# Altium schematic sheet Connector_ETH.SchDoc: =SheetTitle_Top
size 420 x 297 mm; EDA_Number: ARTIQ; Author: G.Kasprowicz; CompanyName: WUT ISE; DrawnBy: G.Kasprowicz; Organization: WUT ISE; Address1: PW ISE; Address2: Nowowiejska 15/19 00-665 Warsaw; Address3: gkasprow@gmail.com; ModifiedBy: -; CheckedDate: -; Title2: Connector Ethernet; DivGrp: WUT ISE; Designer: G.Kasprowicz; ModifiedDate: -; ProjectName: Sensor Box
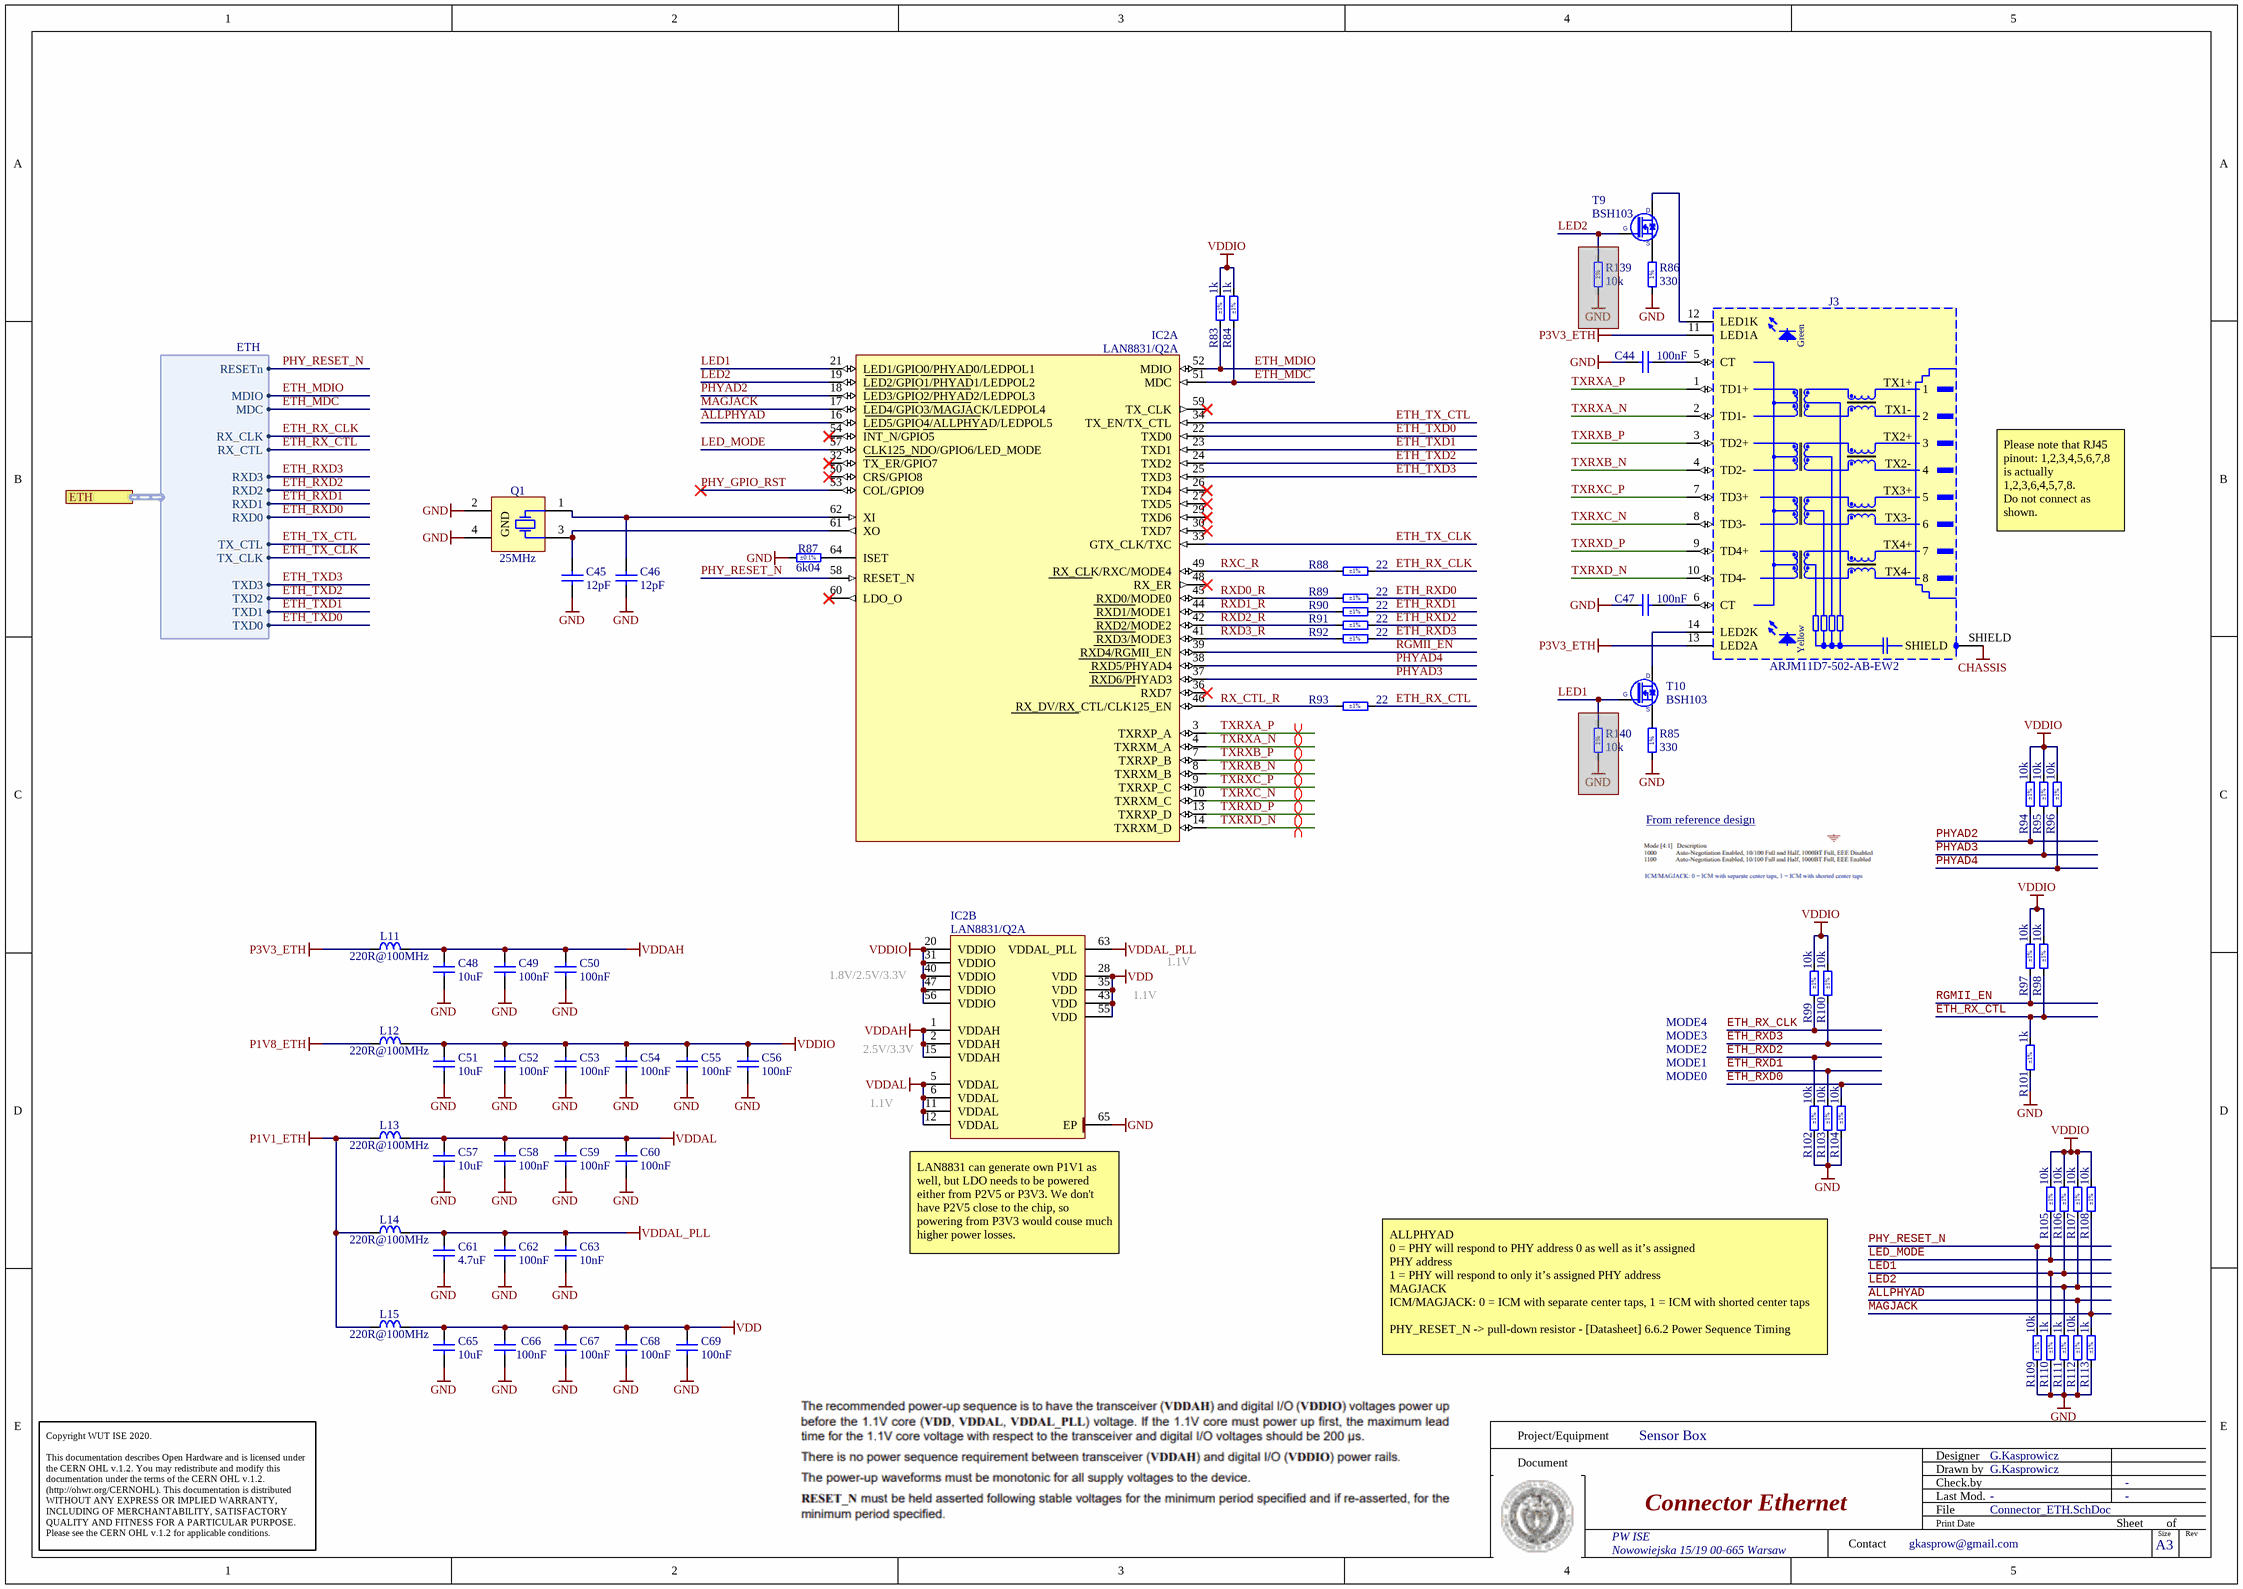
[diagram p0: Connector_ETH.SchDoc]

## Parts
C44  100nF  [CAPC1005X55N]
C45  12pF  [CAPC1005X61N]
C46  12pF  [CAPC1005X61N]
C47  100nF  [CAPC1005X55N]
C48  10uF  [CAPC1005X70N]
C49  100nF  [CAPC1005X55N]
C50  100nF  [CAPC1005X55N]
C51  10uF  [CAPC1005X70N]
C52  100nF  [CAPC1005X55N]
C53  100nF  [CAPC1005X55N]
C54  100nF  [CAPC1005X55N]
C55  100nF  [CAPC1005X55N]
C56  100nF  [CAPC1005X55N]
C57  10uF  [CAPC1005X70N]
C58  100nF  [CAPC1005X55N]
C59  100nF  [CAPC1005X55N]
C60  100nF  [CAPC1005X55N]
C61  4.7uF  [CAPC1005X55N]
C62  100nF  [CAPC1005X55N]
C63  10nF  [CAPC1005X55N]
C65  10uF  [CAPC1005X70N]
C66  100nF  [CAPC1005X55N]
C67  100nF  [CAPC1005X55N]
C68  100nF  [CAPC1005X55N]
C69  100nF  [CAPC1005X55N]
IC2  LAN8831/Q2A  [MICROCHIP_Q2A]  (parts A,B of 2)
J3  ARJM11D7-502-AB-EW2  [ABRACON-ARJM11D7-502-AB-EW2]
L11  220R@100MHz  [INDC2012X105N]
L12  220R@100MHz  [INDC2012X105N]
L13  220R@100MHz  [INDC2012X105N]
L14  220R@100MHz  [INDC2012X105N]
L15  220R@100MHz  [INDC2012X105N]
Q1  25MHz  [XTAL_NDK_NX3225GA]
R83  1k  Tolerance: ±1%  [RESC1005X40N]
R84  1k  Tolerance: ±1%  [RESC1005X40N]
R85  330  [RESC1608X55N]
R86  330  [RESC1608X55N]
R87  6k04  Tolerance: ±0.1%  [RESC1608X55N]
R88  22  Tolerance: ±1%  [RESC1005X40N]
R89  22  Tolerance: ±1%  [RESC1005X40N]
R90  22  Tolerance: ±1%  [RESC1005X40N]
R91  22  Tolerance: ±1%  [RESC1005X40N]
R92  22  Tolerance: ±1%  [RESC1005X40N]
R93  22  Tolerance: ±1%  [RESC1005X40N]
R94  10k  Tolerance: ±1%  [RESC1005X40N]
R95  10k  Tolerance: ±1%  [RESC1005X40N]
R96  10k  Tolerance: ±1%  [RESC1005X40N]
R97  10k  Tolerance: ±1%  [RESC1005X40N]
R98  10k  Tolerance: ±1%  [RESC1005X40N]
R99  10k  Tolerance: ±1%  [RESC1005X40N]
R100  10k  Tolerance: ±1%  [RESC1005X40N]
R101  1k  Tolerance: ±1%  [RESC1005X40N]
R102  10k  Tolerance: ±1%  [RESC1005X40N]
R103  10k  Tolerance: ±1%  [RESC1005X40N]
R104  10k  Tolerance: ±1%  [RESC1005X40N]
R105  10k  Tolerance: ±1%  [RESC1005X40N]
R106  10k  Tolerance: ±1%  [RESC1005X40N]
R107  10k  Tolerance: ±1%  [RESC1005X40N]
R108  10k  Tolerance: ±1%  [RESC1005X40N]
R109  10k  Tolerance: ±1%  [RESC1005X40N]
R110  1k  Tolerance: ±1%  [RESC1005X40N]
R111  1k  Tolerance: ±1%  [RESC1005X40N]
R112  10k  Tolerance: ±1%  [RESC1005X40N]
R113  1k  Tolerance: ±1%  [RESC1005X40N]
R139  10k  [RESC1005X40N]  (masked out: inside a compile mask, not in the netlist)
R140  10k  [RESC1005X40N]  (masked out: inside a compile mask, not in the netlist)
T9  BSH103  [SOT95P230X110-3N]
T10  BSH103  [SOT95P230X110-3N]

## Ports
ETH (harness ETH)

## Harnesses
ETH: RXD3, RXD2, RX_CLK, RX_CTL, RXD1, RXD0, TX_CTL, TX_CLK, TXD3, TXD2, TXD1, TXD0, MDIO, MDC, RESETn

## Nets
CHASSIS: J3.SHIELD
GND: C44.2 C45.1 C46.2 C47.2 C48.1 C49.2 C50.2 C51.1 C52.2 C53.2 C54.2 C55.2 C56.2 C57.1 C58.2 C59.2 C60.2 C61.1 C62.2 C63.1 C65.1 C66.2 C67.2 C68.2 C69.2 IC2.65(EP) Q1.2(GND) Q1.4(GND) R85.1 R86.1 R87.1 R101.1 R102.1 R103.1 R104.1 R109.2 R110.1 R111.1 R112.1 R113.1
P1V1_ETH: L13.1 L14.1 L15.1
P1V8_ETH: L12.1
P3V3_ETH: J3.11(LED1A) J3.13(LED2A) L11.1
VDD: C65.2 C66.1 C67.1 C68.1 C69.1 IC2.28(VDD) IC2.35(VDD) IC2.43(VDD) IC2.55(VDD) L15.2
VDDAH: C48.2 C49.1 C50.1 IC2.1(VDDAH) IC2.2(VDDAH) IC2.15(VDDAH) L11.2
VDDAL: C57.2 C58.1 C59.1 C60.1 IC2.5(VDDAL) IC2.6(VDDAL) IC2.11(VDDAL) IC2.12(VDDAL) L13.2
VDDAL_PLL: C61.2 C62.1 C63.2 IC2.63(VDDAL_PLL) L14.2
VDDIO: C51.2 C52.1 C53.1 C54.1 C55.1 C56.1 IC2.20(VDDIO) IC2.31(VDDIO) IC2.40(VDDIO) IC2.47(VDDIO) IC2.56(VDDIO) L12.2 R83.2 R84.2 R94.2 R95.2 R96.2 R97.2 R98.2 R99.2 R100.2 R105.2 R106.2 R107.2 R108.2
ALLPHYAD: IC2.16(LED5/GPIO4/ALLPHYAD/LEDPOL5) R112.2
ETH_MDC: IC2.51(MDC) R84.1 ; port ETH.MDC
ETH_MDIO: IC2.52(MDIO) R83.1 ; port ETH.MDIO
ETH_RX_CLK: R88.2 R99.1 ; port ETH.RX_CLK
ETH_RX_CTL: R93.2 R98.1 R101.2 ; port ETH.RX_CTL
ETH_RXD0: R89.2 R104.2 ; port ETH.RXD0
ETH_RXD1: R90.2 R103.2 ; port ETH.RXD1
ETH_RXD2: R91.2 R102.2 ; port ETH.RXD2
ETH_RXD3: R92.2 R100.1 ; port ETH.RXD3
ETH_TX_CLK: IC2.33(GTX_CLK/TXC) ; port ETH.TX_CLK
ETH_TX_CTL: IC2.34(TX_EN/TX_CTL) ; port ETH.TX_CTL
ETH_TXD0: IC2.22(TXD0) ; port ETH.TXD0
ETH_TXD1: IC2.23(TXD1) ; port ETH.TXD1
ETH_TXD2: IC2.24(TXD2) ; port ETH.TXD2
ETH_TXD3: IC2.25(TXD3) ; port ETH.TXD3
LED1: IC2.21(LED1/GPIO0/PHYAD0/LEDPOL1) R106.1 R110.2 T10.1(G)
LED2: IC2.19(LED2/GPIO1/PHYAD1/LEDPOL2) R107.1 R111.2 T9.1(G)
LED_MODE: IC2.57(CLK125_NDO/GPIO6/LED_MODE) R105.1
MAGJACK: IC2.17(LED4/GPIO3/MAGJACK/LEDPOL4) R108.1 R113.2
PHY_GPIO_RST: IC2.53(COL/GPIO9)
PHY_RESET_N: IC2.58(RESET_N) R109.1 ; port ETH.RESETn
PHYAD2: IC2.18(LED3/GPIO2/PHYAD2/LEDPOL3) R94.1
PHYAD3: IC2.37(RXD6/PHYAD3) R95.1
PHYAD4: IC2.38(RXD5/PHYAD4) R96.1
RGMII_EN: IC2.39(RXD4/RGMII_EN) R97.1
RX_CTL_R: IC2.46(RX_DV/RX_CTL/CLK125_EN) R93.1
RXC_R: IC2.49(RX_CLK/RXC/MODE4) R88.1
RXD0_R: IC2.45(RXD0/MODE0) R89.1
RXD1_R: IC2.44(RXD1/MODE1) R90.1
RXD2_R: IC2.42(RXD2/MODE2) R91.1
RXD3_R: IC2.41(RXD3/MODE3) R92.1
TXRXA_N: IC2.4(TXRXM_A) J3.2(TD1-)
TXRXA_P: IC2.3(TXRXP_A) J3.1(TD1+)
TXRXB_N: IC2.8(TXRXM_B) J3.4(TD2-)
TXRXB_P: IC2.7(TXRXP_B) J3.3(TD2+)
TXRXC_N: IC2.10(TXRXM_C) J3.8(TD3-)
TXRXC_P: IC2.9(TXRXP_C) J3.7(TD3+)
TXRXD_N: IC2.14(TXRXM_D) J3.10(TD4-)
TXRXD_P: IC2.13(TXRXP_D) J3.9(TD4+)
NetC44_1: C44.1 J3.5(CT)
NetC45_2: C45.2 IC2.61(XO) Q1.3(X)
NetC46_1: C46.1 IC2.62(XI) Q1.1(X)
NetC47_1: C47.1 J3.6(CT)
NetIC2_64: IC2.64(ISET) R87.2
NetJ3_12: J3.12(LED1K) T9.3(D)
NetJ3_14: J3.14(LED2K) T10.3(D)
NetR85_2: R85.2 T10.2(S)
NetR86_2: R86.2 T9.2(S)

Not connected (* = marked no-connect by the designer): IC2 26(TXD4)* 27(TXD5)* 29(TXD6)* 30(TXD7)* 32(TX_ER/GPIO7)* 36(RXD7)* 48(RX_ER)* 50(CRS/GPIO8)* 54(INT_N/GPIO5)* 59(TX_CLK)* 60(LDO_O)*

## Layout directives
differential pair: TXRXA_N, TXRXA_P, TXRXB_N, TXRXB_P, TXRXC_N, TXRXC_P, TXRXD_N, TXRXD_P

## Notes on the sheet
- (near J3) Please note that RJ45 pinout: 1,2,3,4,5,6,7,8 is actually 1,2,3,6,4,5,7,8.
  Do not connect as shown.
- From reference design <https://ww1.microchip.com/downloads/aemDocuments/documents/UNG/ProductDocuments/BoardDesignFiles/LAN8831+Hardware+Reference+Design+-+RGMII+SCH.PDF>
- (near IC2) 1.8V/2.5V/3.3V
- (near IC2) 1.1V
- 1.1V
- (near IC2) 2.5V/3.3V
- MODE4
- MODE3
- MODE2
- MODE1
- MODE0
- (near IC2) LAN8831 can generate own P1V1 as well, but LDO needs to be powered either from P2V5 or P3V3. We don't have P2V5 close to the chip, so powering from P3V3 would couse much higher power losses.
- ALLPHYAD
  0 = PHY will respond to PHY address 0 as well as it’s assigned
  PHY address
  1 = PHY will respond to only it’s assigned PHY address
  MAGJACK
  ICM/MAGJACK: 0 = ICM with separate center taps, 1 = ICM with shorted center taps
  PHY_RESET_N -> pull-down resistor - [Datasheet] 6.6.2 Power Sequence Timing
- Project/Equipment
- Document
- Designer
- Drawn by
- Check.by
- Copyright WUT ISE 2020.
  This documentation describes Open Hardware and is licensed under the CERN OHL v.1.2. You may redistribute and modify this documentation under the terms of the CERN OHL v.1.2. (http://ohwr.org/CERNOHL). This documentation is distributed WITHOUT ANY EXPRESS OR IMPLIED WARRANTY, INCLUDING OF MERCHANTABILITY, SATISFACTORY QUALITY AND FITNESS FOR A PARTICULAR PURPOSE. Please see the CERN OHL v.1.2 for applicable conditions.
- Contact
- File
- Last Mod.
- Print Date
- Sheet
- Size
- A3
- of
- Rev
- (in symbol ABRACON-ARJM11D7-502-AB-EW2) Green; TX1+; TX1-; TX2+; TX2-; TX3+; TX3-; TX4+; TX4-; Yellow
- (in symbol R0402_10K_1%_0.0625W_100PPM) 1%
- (in symbol R0603_330R_1%_0.1W_100PPM) 1%

## Library data of the parts
C44 C47 C49 C50 C52-C56 C58-C60 C62 C66-C69 = CC0402_100NF_25V_10%_X7R_YUDEN_TMK105B7104KVHF: Non-polarised capacitor; Part Description: SMD Multilayer Chip Ceramic Capacitor (High Dielectric Type) for Automotive / Industrial Applications; Manufacturer: TAIYO YUDEN; Voltage: 25V; TC: X7R; Tolerance: ±10%; Part Number: CC0402_100NF_25V_10%_X7R_YUDEN_TMK105B7104KVHF; Component Kind: Standard; Component Type: Standard; Pin Count: 2; Value: 100nF; Status: Not Recommended; Manufacturer Part Number: TMK105B7104KVHF; Case: 0402; Mounted: Yes; Socket: No; SMD: Yes; HelpURL: \\cern.ch\dfs\Applications\Altium\Datasheets\CC0402_TAIYO-YUDEN_TMK105B7104KVHF.pdf; Author: CERN DEM JLC; CreateDate: 10-May-17; LatestRevisionDate: 10-May-17; Sense: No; ComponentHeight: 0.55mm
C45 C46 = CC0402_12PF_50V_1%_NP0_JOHANSON_R07S: Non-polarised capacitor; Part Description: Ultra High-Q SMD Multilayer Capacitor; Manufacturer: JOHANSON TECHNOLOGY; Manufacturer Part Number: 500R07S120FV4T; Voltage: 50V; TC: C0G/NP0; Tolerance: ±1%; Part Number: CC0402_12PF_50V_1%_NP0_JOHANSON_R07S; Component Kind: Standard; Component Type: Standard; Pin Count: 2; Value: 12pF; Status: Not Recommended; Case: 0402; Mounted: Yes; Socket: No; SMD: Yes; Sense: No; ComponentHeight: 0.61mm; HelpURL: \\cern.ch\dfs\Applications\Altium\Datasheets\CC0402_NP0_JOHANSON_R07S.pdf; Author: CERN DEM BC; CreateDate: 20.11.2017; LatestRevisionDate: 26.09.2018
C48 C51 C57 C65 = CC0402_10UF_6.3V_20%_X5R: Non-polarised capacitor; Part Description: SMD Multilayer Chip Ceramic Capacitor; Manufacturer: GENERIC; Manufacturer1 Part Number: C1005X5R0J106M050; Voltage: 6.3V; TC: X5R; Tolerance: ±10%; Part Number: CC0402_10UF_6.3V_20%_X5R; Component Kind: Standard; Component Type: Standard; Pin Count: 2; Value: 10uF; Status: Preferred; Manufacturer Part Number: CC0402_10UF_6.3V_20%_X5R; Case: 0402; Mounted: Yes; Socket: No; SMD: Yes; Manufacturer1 Example: TDK; Manufacturer1 ComponentHeight: 0.70mm; HelpURL: \\cern.ch\dfs\Applications\Altium\Datasheets\CC0402_X5R_TDK_C.pdf; Author: CERN DEM JLC; CreateDate: 1/7/2015; LatestRevisionDate: 1/7/2015; Sense: No
C61 = CC0402_4.7UF_6.3V_20%_X5R: Non-polarised capacitor; Part Description: SMD Multilayer Chip Ceramic Capacitor; Manufacturer: GENERIC; Manufacturer1 Part Number: C1005X5R0J475M050; Voltage: 6.3V; TC: X5R; Tolerance: ±20%; Part Number: CC0402_4.7UF_6.3V_20%_X5R; Component Kind: Standard; Component Type: Standard; Pin Count: 2; Value: 4.7uF; Status: Preferred; Manufacturer Part Number: CC0402_4.7UF_6.3V_20%_X5R; Case: 0402; Mounted: Yes; Socket: No; SMD: Yes; Sense: No; Manufacturer1 Example: TDK; Manufacturer1 ComponentHeight: 0.65mm; HelpURL: \\cern.ch\dfs\Applications\Altium\Datasheets\CC0402_X5R_TDK_C.pdf; Author: CERN DEM JLC; CreateDate: 3/3/2015; LatestRevisionDate: 3/3/2015
C63 = CC0402_10NF_16V_10%_X7R: Non-polarised capacitor; Part Description: SMD Multilayer Chip Ceramic Capacitor; Manufacturer: GENERIC; Manufacturer1 Part Number: 223878715636; Voltage: 16V; TC: X7R; Tolerance: ±10%; Part Number: CC0402_10NF_16V_10%_X7R; Component Kind: Standard; Component Type: Standard; Pin Count: 2; Value: 10nF; Status: Not Recommended; Manufacturer Part Number: CC0402_10NF_16V_10%_X7R; Case: 0402; Mounted: Yes; Socket: No; SMD: Yes; Sense: No; Manufacturer1 Example: PHYCOMP; Manufacturer1 ComponentHeight: 0.55mm; HelpURL: \\cern.ch\dfs\Applications\Altium\Datasheets\CC0402_X7R_PHYCOMP.pdf; Author: CERN DEM JLC; CreateDate: 03.12.2007; LatestRevisionDate: 03.12.2007
IC2 = LAN8831/Q2A: Gigabit Ethernet Transceiver with GMII/MII/RGMII; Manufacturer: MICROCHIP TECHNOLOGY; PressFit: No; Bonding: No; Part Number: LAN8831/Q2A; Component Kind: Standard; Component Type: Standard; Device: LAN8831/Q2A; PackageDescription: QFN, 0.40mm Pitch, Square; 64 Pin, 8.00mm L X 8.00mm W X 0.90mm H body (w/Thermal Tab 6.55 X 6.55mm), IPC Medium Density; Part Description: Gigabit Ethernet Transceiver with GMII/MII/RGMII; Manufacturer Part Number: LAN8831/Q2A; Pin Count: 65; Case: QFN64; Mounted: Yes; Socket: No; SMD: Yes; Sense: No; ComponentHeight: 0.9mm; Author: CERN DEM HF; HelpURL: \\cern.ch\dfs\Applications\Altium\Datasheets\LAN8831.pdf; CreateDate: 29.09.2023; LatestRevisionDate: 03.10.2023
J3 = ABRACON-ARJM11D7-502-AB-EW2: 1 Port, Green/Yellow LEDs, RJ45 1Gigabit Ethernet, MagJack Connector Module; Part Description: DC-10MBd Versatile Link Fiber Optic Analog Transmitter for 1 mm POF and 200 µm PCS; PressFit: No; Part Number: ABRACON-ARJM11D7-502-AB-EW2; Component Kind: Standard; Component Type: Standard; Device: ARJM11D7-502-AB-EW2; Pin Count: 14; Family: RJ45; Mounted: Yes; Socket: No; SMD: No; Sense: No; Status: None; Manufacturer: ABRACON; Manufacturer Part Number: ARJM11D7-502-AB-EW2; ComponentHeight: 13.8mm; HelpURL: \\cern.ch\dfs\Applications\Altium\Datasheets\ARJM11D7-502-AB-EW2.pdf; Author: CERN DEM HF; CreateDate: 29.09.2023; LatestRevisionDate: 29.09.2023
L11-L15 = IND0805_MURATA_BLM21PG221SN1D: Inductor; Part Description: SMD EMIFIL Suppression Chip Ferrite Bead; Manufacturer: MURATA; Power: 2A; Resistance: 0.05R; Tolerance: ±25%; Part Number: IND0805_MURATA_BLM21PG221SN1D; Component Kind: Standard; Component Type: Standard; Pin Count: 2; Value: 220R@100MHz; Manufacturer Part Number: BLM21PG221SN1; Case: 0805; Mounted: Yes; Socket: No; SMD: Yes; Sense: No; ComponentHeight: 1.05mm; HelpURL: \\cern.ch\dfs\Applications\Altium\Datasheets\IND0805_MURATA_BLM21P.pdf; Author: CERN DEM JLC; CreateDate: 1/25/2010; LatestRevisionDate: 10/25/2018
Q1 = XTAL_25MHZ_NDK_NX3225GA: Crystal 4 pins 1=XTAL Control 2=GND3=XTAL 4=GND; Part Description: Tolerance: ±20ppm, Stability: ±30ppm, -40°C to +85°C, 8pF, 50 Ohms ESR, Automotive Quartz Crystal, NX3225GA Series; Manufacturer: NDK; Manufacturer Part Number: NX3225GA-25.000M-STD-CRG; PressFit: No; Bonding: No; Part Number: XTAL_25MHZ_NDK_NX3225GA; Component Kind: Standard; Component Type: Standard; PackageDescription: 4 Pins, SMD Crystal, Body 2.5x3.2mm, NX3225GA Series; Value: 25MHz; Pin Count: 4; Mounted: Yes; Socket: No; SMD: Yes; Sense: No; ComponentHeight: 0.9mm; HelpURL: \\cern.ch\dfs\Applications\Altium\Datasheets\XTAL_NDK_NX3225GA.pdf; Author: CERN DEM MR; CreateDate: 15.02.2018; LatestRevisionDate: 15.02.2018
R83 R84 R101 R110 R111 R113 = R0402_1K_1%_0.0625W_100PPM: Resistor - 1%; Part Description: General Purpose Thick Film Chip Resistor; Manufacturer: GENERIC; Manufacturer1 Part Number: 232270671002L; TC: ±100ppm/°C; PressFit: No; Part Number: R0402_1K_1%_0.0625W_100PPM; Component Kind: Standard; Component Type: Standard; Pin Count: 2; Value: 1k; Status: Not Recommended; Power: 0.0625W; Manufacturer Part Number: R0402_1K_1%_0.0625W_100PPM; Case: 0402; Mounted: Yes; Sense: No; Socket: No; SMD: Yes; Manufacturer1 Example: YAGEO PHYCOMP; Manufacturer1 ComponentHeight: 0.4mm; HelpURL: \\cern.ch\dfs\Applications\Altium\Datasheets\R0402_Phycomp_RC0402.pdf; Author: CERN DEM JLC; CreateDate: 03.12.2007; LatestRevisionDate: 17.10.2012
R85 R86 = R0603_330R_1%_0.1W_100PPM: Resistor - 1%; Part Description: General Purpose Thick Film Chip Resistor; Manufacturer: GENERIC; Manufacturer1 Part Number: NRC06F3300TRF; Power: 0.1W; TC: ±100ppm/°C; PressFit: No; Part Number: R0603_330R_1%_0.1W_100PPM; Component Kind: Standard; Component Type: Standard; Pin Count: 2; Value: 330; Status: Preferred; Tolerance: ±1%; Manufacturer Part Number: R0603_330R_1%_0.1W_100PPM; Case: 0603; Mounted: Yes; Socket: No; SMD: Yes; Manufacturer1 Example: NIC COMPONENT; Manufacturer1 ComponentHeight: 0.55mm; HelpURL: \\cern.ch\dfs\Applications\Altium\Datasheets\R0603_NIC_NRC.pdf; Author: CERN DEM JLC; CreateDate: 03-Dec-07; LatestRevisionDate: 13-Mar-08; Sense: No
R87 = R0603_6K04_0.1%_0.063W_10PPM: Resistor - 0.1%; Part Description: Thin Film Chip Resistor; Manufacturer: GENERIC; Manufacturer1 Part Number: RN73C1J6K04BTDF; Power: 0.063W; TC: ±10ppm; PressFit: No; Part Number: R0603_6K04_0.1%_0.063W_10PPM; Component Kind: Standard; Component Type: Standard; Pin Count: 2; Value: 6k04; Status: Not Recommended; Manufacturer Part Number: R0603_6K04_0.1%_0.063W_10PPM; Case: 0603; Mounted: Yes; Sense: No; Socket: No; SMD: Yes; Manufacturer1 Example: TYCO HOLSWORTHY; Manufacturer1 ComponentHeight: 0.5mm; HelpURL: \\cern.ch\dfs\Applications\Altium\Datasheets\R0603_Tyco_RN73.pdf; Author: CERN DEM JLC; CreateDate: 03.12.2007; LatestRevisionDate: 13.03.2008
R88-R93 = R0402_22R_1%_0.0625W_100PPM: Resistor - 1%; Part Description: General Purpose Thick Film Chip Resistor; Manufacturer: GENERIC; Manufacturer1 Part Number: 232270672209L; TC: ±100ppm/°C; PressFit: No; Part Number: R0402_22R_1%_0.0625W_100PPM; Component Kind: Standard; Component Type: Standard; Pin Count: 2; Value: 22; Status: Not Recommended; Power: 0.0625W; Manufacturer Part Number: R0402_22R_1%_0.0625W_100PPM; Case: 0402; Mounted: Yes; Sense: No; Socket: No; SMD: Yes; Manufacturer1 Example: YAGEO PHYCOMP; Manufacturer1 ComponentHeight: 0.4mm; HelpURL: \\cern.ch\dfs\Applications\Altium\Datasheets\R0402_Phycomp_RC0402.pdf; Author: CERN DEM JLC; CreateDate: 03.12.2007; LatestRevisionDate: 17.10.2012
R94-R100 R102-R109 R112 R139 R140 = R0402_10K_1%_0.0625W_100PPM: Resistor - 1%; Part Description: General Purpose Thick Film Chip Resistor; Manufacturer: GENERIC; Manufacturer1 Part Number: 232270671003L; TC: ±100ppm/°C; PressFit: No; Part Number: R0402_10K_1%_0.0625W_100PPM; Component Kind: Standard; Component Type: Standard; Pin Count: 2; Value: 10k; Status: Not Recommended; Power: 0.0625W; Manufacturer Part Number: R0402_10K_1%_0.0625W_100PPM; Case: 0402; Mounted: Yes; Sense: No; Socket: No; SMD: Yes; Manufacturer1 Example: YAGEO PHYCOMP; Manufacturer1 ComponentHeight: 0.4mm; HelpURL: \\cern.ch\dfs\Applications\Altium\Datasheets\R0402_Phycomp_RC0402.pdf; Author: CERN DEM JLC; CreateDate: 03.12.2007; LatestRevisionDate: 17.10.2012
  R139 R140: Tolerance: ±1%
T9 T10 = BSH103: N-CHANNEL MOSFET WITH DIODE; Part Description: 30V 850mA N-Channel Enhancement Mode Field-Effect Transistor; Manufacturer: NEXPERIA; PressFit: No; Bonding: No; Part Number: BSH103; Component Kind: Standard; Component Type: Standard; Device: BSH103; PackageDescription: SOT23, 0.95mm Pitch; 3 Pin, 1.30mm W X 2.90mm L X 1.10mm H body, IPC Medium Density; Manufacturer Part Number: BSH103; Pin Count: 3; Case: SOT23-3; Mounted: Yes; Socket: No; SMD: Yes; Sense: No; ComponentHeight: 1.1mm; HelpURL: \\cern.ch\dfs\Applications\Altium\Datasheets\BSH103.pdf; Author: CERN DEM JLC; CreateDate: 16.03.2010; LatestRevisionDate: 20.06.2017